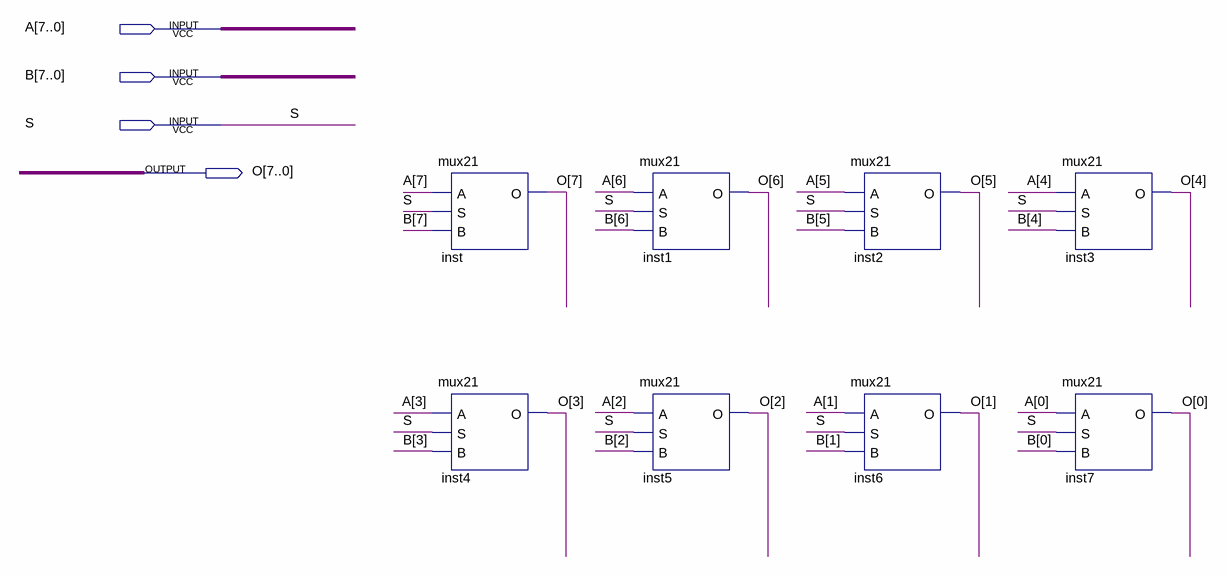
[diagram p0: schematic sheet]
// Quartus schematic mux21_8b.bdf as structural Verilog: 8 symbols, 4 pins
module mux21_8b (
  input  [7:0] A,
  input  [7:0] B,
  input  S,
  output [7:0] O
);

  mux21 inst (.A(A[7]), .S(S), .B(B[7]), .O(O[7]));
  mux21 inst4 (.A(A[3]), .S(S), .B(B[3]), .O(O[3]));
  mux21 inst1 (.A(A[6]), .S(S), .B(B[6]), .O(O[6]));
  mux21 inst5 (.A(A[2]), .S(S), .B(B[2]), .O(O[2]));
  mux21 inst2 (.A(A[5]), .S(S), .B(B[5]), .O(O[5]));
  mux21 inst6 (.A(A[1]), .S(S), .B(B[1]), .O(O[1]));
  mux21 inst3 (.A(A[4]), .S(S), .B(B[4]), .O(O[4]));
  mux21 inst7 (.A(A[0]), .S(S), .B(B[0]), .O(O[0]));
endmodule
